# Altium schematic sheet MCU.SchDoc
size A4
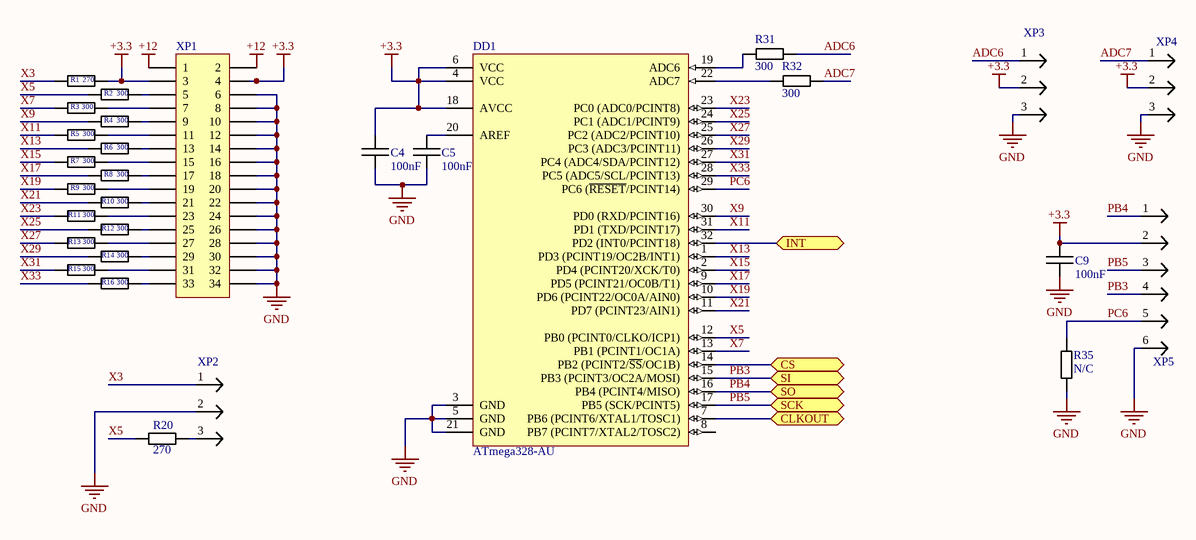
[diagram p0: MCU.SchDoc]

## Parts
C4  Val: 100nF  [CAPC1206(3216)170_L]  (hidden comment: CAP_SMD)
C5  Val: 100nF  [CAPC1206(3216)170_L]  (hidden comment: CAP_SMD)
C9  Val: 100nF  [CAPC1206(3216)170_L]  (hidden comment: CAP_SMD)
DD1  ATmega328-AU  [32A_L]
R1  Val: 270  [RESC1206(3216)_L]  (hidden comment: RES_SMD)
R2  Val: 300  [RESC1206(3216)_L]  (hidden comment: RES_SMD)
R3  Val: 300  [RESC1206(3216)_L]  (hidden comment: RES_SMD)
R4  Val: 300  [RESC1206(3216)_L]  (hidden comment: RES_SMD)
R5  Val: 300  [RESC1206(3216)_L]  (hidden comment: RES_SMD)
R6  Val: 300  [RESC1206(3216)_L]  (hidden comment: RES_SMD)
R7  Val: 300  [RESC1206(3216)_L]  (hidden comment: RES_SMD)
R8  Val: 300  [RESC1206(3216)_L]  (hidden comment: RES_SMD)
R9  Val: 300  [RESC1206(3216)_L]  (hidden comment: RES_SMD)
R10  Val: 300  [RESC1206(3216)_L]  (hidden comment: RES_SMD)
R11  Val: 300  [RESC1206(3216)_L]  (hidden comment: RES_SMD)
R12  Val: 300  [RESC1206(3216)_L]  (hidden comment: RES_SMD)
R13  Val: 300  [RESC1206(3216)_L]  (hidden comment: RES_SMD)
R14  Val: 300  [RESC1206(3216)_L]  (hidden comment: RES_SMD)
R15  Val: 300  [RESC1206(3216)_L]  (hidden comment: RES_SMD)
R16  Val: 300  [RESC1206(3216)_L]  (hidden comment: RES_SMD)
R20  Val: 270  [RESC1206(3216)_L]  (hidden comment: RES_SMD)
R31  Val: 300  [RESC1206(3216)_L]  (hidden comment: RES_SMD)
R32  Val: 300  [RESC1206(3216)_L]  (hidden comment: RES_SMD)
R35  Val: N/C  [RESC1206(3216)_L]  (hidden comment: RES_SMD)
XP1  (no value)  [HDR2X17]
XP2  PBS-03  [PBS-03]  (value not drawn)
XP3  PLS-03  [PLS-03]  (value not drawn)
XP4  PLS-03  [PLS-03]  (value not drawn)
XP5  PLS-03_2  [PLS-03_2]  (value not drawn)

## Ports
CLKOUT (bidir), CS (bidir), INT (bidir), SCK (bidir), SI (bidir), SO (bidir)

## Nets
+3.3: C4.2 C9.2 DD1.4(VCC) DD1.6(VCC) DD1.18(AVCC) R1.2 XP1.3 XP1.4 XP3.2 XP4.2 XP5.2
+12: XP1.1 XP1.2
GND: C4.1 C5.1 C9.1 DD1.3(GND) DD1.5(GND) DD1.21(GND) R35.1 XP1.6 XP1.8 XP1.10 XP1.12 XP1.14 XP1.16 XP1.18 XP1.20 XP1.22 XP1.24 XP1.26 XP1.28 XP1.30 XP1.32 XP1.34 XP2.2 XP3.3 XP4.3 XP5.6
ADC6: R31.2 XP3.1
ADC7: R32.2 XP4.1
CLKOUT: DD1.7(PB6_(PCINT6/XTAL1/TOSC1)) ; port CLKOUT
CS: DD1.14(PB2_(PCINT2/~{SS}/OC1B)) ; port CS
INT: DD1.32(PD2_(INT0/PCINT18)) ; port INT
PB3: DD1.15(PB3_(PCINT3/OC2A/MOSI)) XP5.4 ; port SI
PB4: DD1.16(PB4_(PCINT4/MISO)) XP5.1 ; port SO
PB5: DD1.17(PB5_(SCK/PCINT5)) XP5.3 ; port SCK
PC6: DD1.29(PC6_(~{RESET}/PCINT14)) R35.2 XP5.5
X3: R1.1 XP2.1
X5: DD1.12(PB0_(PCINT0/CLKO/ICP1)) R2.1 R20.1
X7: DD1.13(PB1_(PCINT1/OC1A)) R3.1
X9: DD1.30(PD0_(RXD/PCINT16)) R4.1
X11: DD1.31(PD1_(TXD/PCINT17)) R5.1
X13: DD1.1(PD3_(PCINT19/OC2B/INT1)) R6.1
X15: DD1.2(PD4_(PCINT20/XCK/T0)) R7.1
X17: DD1.9(PD5_(PCINT21/OC0B/T1)) R8.1
X19: DD1.10(PD6_(PCINT22/OC0A/AIN0)) R9.1
X21: DD1.11(PD7_(PCINT23/AIN1)) R10.1
X23: DD1.23(PC0_(ADC0/PCINT8)) R11.1
X25: DD1.24(PC1_(ADC1/PCINT9)) R12.1
X27: DD1.25(PC2_(ADC2/PCINT10)) R13.1
X29: DD1.26(PC3_(ADC3/PCINT11)) R14.1
X31: DD1.27(PC4_(ADC4/SDA/PCINT12)) R15.1
X33: DD1.28(PC5_(ADC5/SCL/PCINT13)) R16.1
NetC5_2: C5.2 DD1.20(AREF)
NetDD1_19: DD1.19(ADC6) R31.1
NetDD1_22: DD1.22(ADC7) R32.1
NetR2_2: R2.2 XP1.5
NetR3_2: R3.2 XP1.7
NetR4_2: R4.2 XP1.9
NetR5_2: R5.2 XP1.11
NetR6_2: R6.2 XP1.13
NetR7_2: R7.2 XP1.15
NetR8_2: R8.2 XP1.17
NetR9_2: R9.2 XP1.19
NetR10_2: R10.2 XP1.21
NetR11_2: R11.2 XP1.23
NetR12_2: R12.2 XP1.25
NetR13_2: R13.2 XP1.27
NetR14_2: R14.2 XP1.29
NetR15_2: R15.2 XP1.31
NetR16_2: R16.2 XP1.33
NetR20_2: R20.2 XP2.3

Not connected (* = marked no-connect by the designer): DD1 8(PB7_(PCINT7/XTAL2/TOSC2))

## Library data of the parts
C4 C5 C9 = CAP_SMD: Ceramic capacitor, 0805
DD1 = ATmega328-AU: 8-bit AVR Microcontroller, 32KB Flash, 1KB EEPROM, 2KB SRAM, 32-pin TQFP, Industrial Grade (-40°C to 85°C); DatasheetVersion: revA, Jan-2010; PackageDescription: 32-Lead, 7x7x1.0 mm Body, 0.8mm Lead Pitch, Thin Profile Plastic Quad Flat Package (TQFP); PackageReference: 32A; Code_JEDEC: MS-026-ABA; PackageVersion: revB, Oct-2001
R1-R16 R20 R31 R32 R35 = RES_SMD: RES0805
XP1 = Header 17X2: Header, 17-Pin, Dual row; LatestRevisionDate: 17-Jul-2002; LatestRevisionNote: Re-released for DXP Platform.; Publisher: Altium Limited